# Altium schematic sheet SchematicDoAn2.SchDoc
size A; SheetNumber: 1; SheetTotal: 1
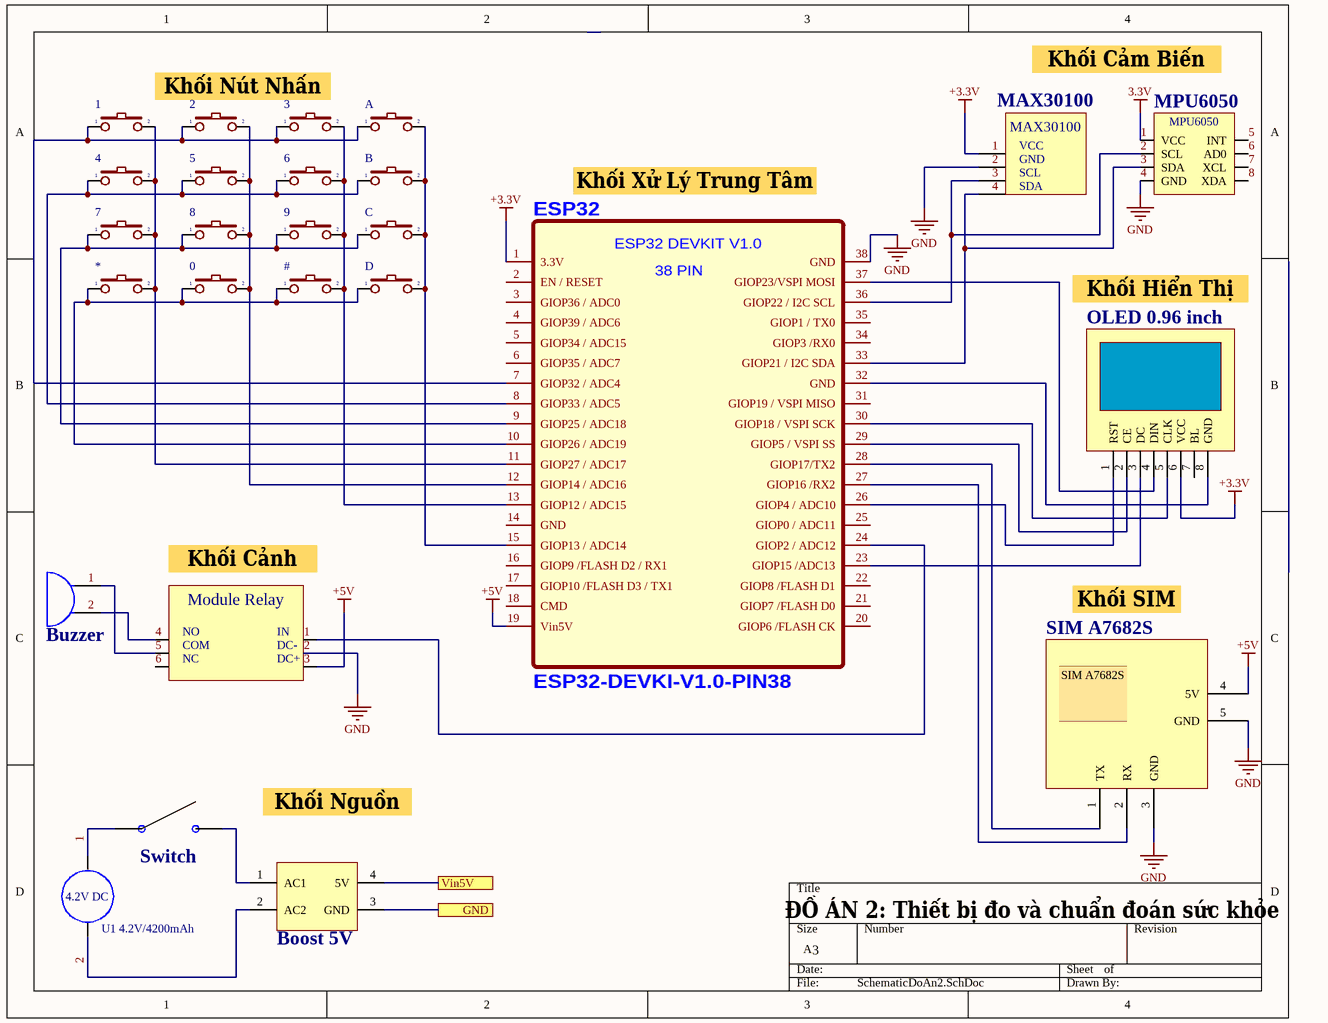
[diagram p0: SchematicDoAn2.SchDoc]

## Parts
0  (no value)  [SW2]
1  (no value)  [SW2]
2  (no value)  [SW2]
3  (no value)  [SW2]
4  (no value)  [SW2]
5  (no value)  [SW2]
6  (no value)  [SW2]
7  (no value)  [SW2]
8  (no value)  [SW2]
9  (no value)  [SW2]
#  (no value)  [SW2]
*  (no value)  [SW2]
?  Buzzer
A  (no value)  [SW2]
B  (no value)  [SW2]
Boost_5V  6V Nokia Charger  [NokiaCharger]  (value not drawn)
C  (no value)  [SW2]
D  (no value)  [SW2]
ESP32  ESP32-DEVKI-V1.0-PIN38  [ESP32-DEVKIT-V1.0-38PIN]
MPU6050  (no value)  [MPU6050]
OLED_0.96_inch  (no value)  [LCD 5110]
SIM_A7682S  (no value)

## Ports
GND, Vin5V

## Nets
1: MPU6050.1(VCC)  [also labelled 3.3V]
2: ?.1(A) Boost_5V.2(AC2) ESP32.36(GIOP22_/_I2C_SCL) ESP32.38(GND) MPU6050.2(GND) MPU6050.3(SCL) SIM_A7682S.3(GND) SIM_A7682S.5(GND)  [also labelled 4, GND]
+3.3V: ESP32.1(3.3V) OLED_0.96_inch.6(VCC)
+5V: ESP32.19(Vin5V) SIM_A7682S.4(5V)
3: ESP32.33(GIOP21_/_I2C_SDA) MPU6050.4(SDA)
5: ?.2(B) MPU6050.8(INT)
6: MPU6050.7(AD0)
7: MPU6050.6(XCL)
8: MPU6050.5(XDA)
GND: Boost_5V.3(GND) ; port GND
Vin5V: Boost_5V.4(5V) ; port Vin5V
Net0_1: 0.1 #.1 *.1 D.1 ESP32.10(GIOP26_/_ADC19)
Net0_2: 0.2 2.2 5.2 8.2 ESP32.12(GIOP14_/_ADC16)
Net1_1: 1.1 2.1 3.1 A.1 ESP32.7(GIOP32_/_ADC4)
Net1_2: 1.2 4.2 7.2 *.2 ESP32.11(GIOP27_/_ADC17)
Net3_2: 3.2 6.2 9.2 #.2 ESP32.13(GIOP12_/_ADC15)
Net4_1: 4.1 5.1 6.1 B.1 ESP32.8(GIOP33_/_ADC5)
Net7_1: 7.1 8.1 9.1 C.1 ESP32.9(GIOP25_/_ADC18)
NetA_2: A.2 B.2 C.2 D.2 ESP32.15(GIOP13_/_ADC14)
NetESP32_23: ESP32.23(GIOP15_/ADC13) OLED_0.96_inch.3(DC)
NetESP32_26: ESP32.26(GIOP4_/_ADC10) OLED_0.96_inch.1(RST)
NetESP32_27: ESP32.27(GIOP16_/RX2) SIM_A7682S.2(RX)
NetESP32_28: ESP32.28(GIOP17/TX2) SIM_A7682S.1(TX)
NetESP32_29: ESP32.29(GIOP5_/_VSPI_SS) OLED_0.96_inch.2(CE)
NetESP32_30: ESP32.30(GIOP18_/_VSPI_SCK) OLED_0.96_inch.5(CLK)
NetESP32_32: ESP32.32(GND) OLED_0.96_inch.8(GND)
NetESP32_37: ESP32.37(GIOP23/VSPI_MOSI) OLED_0.96_inch.4(DIN)

Not connected (* = marked no-connect by the designer): Boost_5V 1(AC1); ESP32 2(EN_/_RESET) 3(GIOP36_/_ADC0) 4(GIOP39_/_ADC6) 5(GIOP34_/_ADC15) 6(GIOP35_/_ADC7) 14(GND) 16(GIOP9_/FLASH_D2_/_RX1) 17(GIOP10_/FLASH_D3_/_TX1) 18(CMD) 20(GIOP6_/FLASH_CK) 21(GIOP7_/FLASH_D0) 22(GIOP8_/FLASH_D1) 24(GIOP2_/_ADC12) 25(GIOP0_/_ADC11) 31(GIOP19_/_VSPI_MISO) 34(GIOP3_/RX0) 35(GIOP1_/_TX0); OLED_0.96_inch 7(BL)

## Notes on the sheet
- Khối Nút Nhấn
- Khối Cảm Biến
- MAX30100
- VCC
- GND
- Khối Xử Lý Trung Tâm
- SCL
- SDA
- Khối Hiển Thị
- Khối Cảnh Báo
- NO
- Module Relay
- IN
- Khối SIM
- COM
- NC
- DC-
- DC+
- (near SIM_A7682S) SIM A7682S
- Khối Nguồn
- 4.2V DC
- Switch
- ĐỒ ÁN 2: Thiết bị đo và chuẩn đoán sức khỏe
- U1 4.2V/4200mAh
- 3
- Labels drawn without touching a wire or pin: 1, 2, 3, 4, 6
- (in symbol ESP32-DEVKI-V1.0-PIN38) ESP32 DEVKIT V1.0; 38 PIN
- (in symbol SIM800A_Module) SIM800A

## Library data of the parts
0-9 # * A B C D = SW2: Switch button 2 pin; Value: SW chip 2 pin
Boost_5V = NokiaCharger: Creator: Bien Nguyen
MPU6050 = MPU6050: Manufacturer: W¨¹rth Elektronik eiSos GmbH; partNo: 613004143121; ComponentLink1 Description: Manufacturer; ComponentLink2 Description: Datasheet; NoPins: 04; Created Date: 29 March 2013; ComponentLink1URL: http://www.we-online.com; ComponentLink2URL: http://katalog.we-online.de/em/datasheet/6130xx143121.pdf; Created by: Karrer Zheng
OLED_0.96_inch = LCD 5110: LCD 5510 nokia
SIM_A7682S = SIM800A_Module: SIM800A Module